# Altium schematic sheet ASK_Demodulation_and_thermistor_control.SchDoc
size A4; SheetNumber: 2; SheetTotal: 3
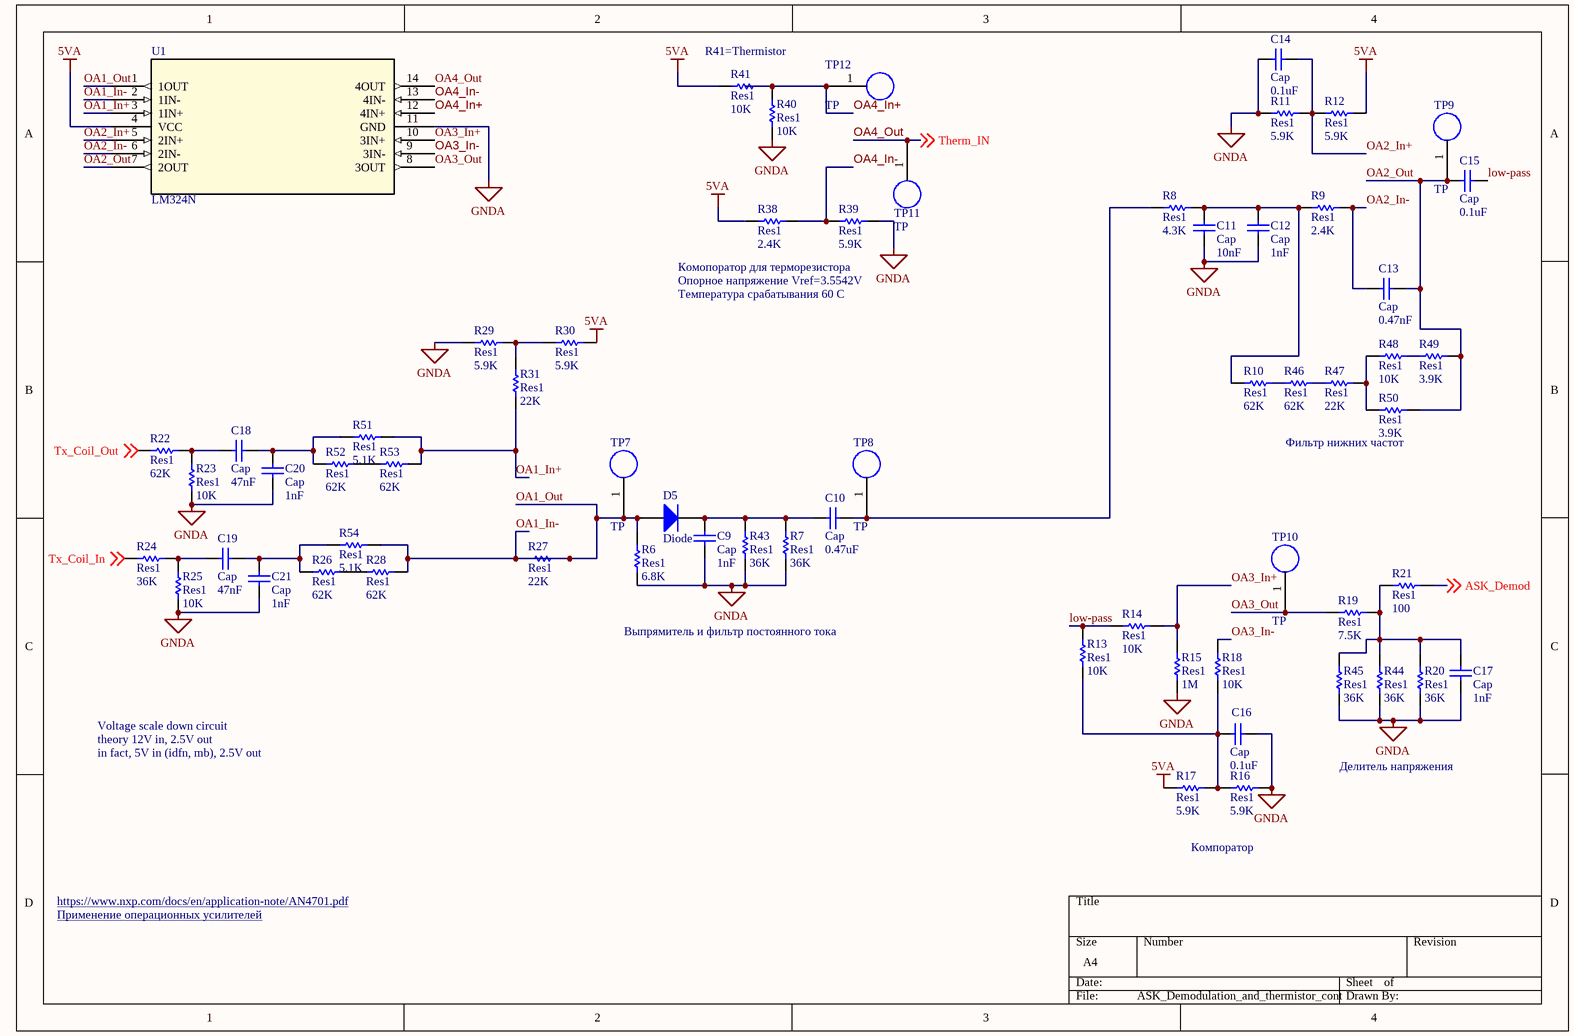
[diagram p0: ASK_Demodulation_and_thermistor_control.SchDoc]

## Parts
C9  Cap  value 1nF  [CAP 0402_1005]
C10  Cap  value 0.47uF  [CAP 0402_1005]
C11  Cap  value 10nF  [CAP 0402_1005]
C12  Cap  value 1nF  [CAP 0402_1005]
C13  Cap  value 0.47nF  [CAP 0402_1005]
C14  Cap  value 0.1uF  [CAP 0402_1005]
C15  Cap  value 0.1uF  [CAP 0402_1005]
C16  Cap  value 0.1uF  [CAP 0402_1005]
C17  Cap  value 1nF  [CAP 0402_1005]
C18  Cap  value 47nF  [CAP 0402_1005]
C19  Cap  value 47nF  [CAP 0402_1005]
C20  Cap  value 1nF  [CAP 0402_1005]
C21  Cap  value 1nF  [CAP 0402_1005]
D5  Diode  [SOD-123]
R6  Res1  value 6.8K  [RES 0402_1005]
R7  Res1  value 36K  [RES 0402_1005]
R8  Res1  value 4.3K  [RES 0402_1005]
R9  Res1  value 2.4K  [RES 0402_1005]
R10  Res1  value 62K  [RES 0402_1005]
R11  Res1  value 5.9K  [RES 0603_1608]
R12  Res1  value 5.9K  [RES 0603_1608]
R13  Res1  value 10K  [RES 0402_1005]
R14  Res1  value 10K  [RES 0402_1005]
R15  Res1  value 1M  [RES 0402_1005]
R16  Res1  value 5.9K  [RES 0603_1608]
R17  Res1  value 5.9K  [RES 0603_1608]
R18  Res1  value 10K  [RES 0402_1005]
R19  Res1  value 7.5K  [RES 0402_1005]
R20  Res1  value 36K  [RES 0402_1005]
R21  Res1  value 100  [RES 0402_1005]
R22  Res1  value 62K  [RES 0402_1005]
R23  Res1  value 10K  [RES 0402_1005]
R24  Res1  value 36K  [RES 0402_1005]
R25  Res1  value 10K  [RES 0402_1005]
R26  Res1  value 62K  [RES 0402_1005]
R27  Res1  value 22K  [RES 0402_1005]
R28  Res1  value 62K  [RES 0402_1005]
R29  Res1  value 5.9K  [RES 0603_1608]
R30  Res1  value 5.9K  [RES 0603_1608]
R31  Res1  value 22K  [RES 0402_1005]
R38  Res1  value 2.4K  [RES 0402_1005]
R39  Res1  value 5.9K  [RES 0603_1608]
R40  Res1  value 10K  [RES 0402_1005]
R41  Res1  value 10K  [RES 0402_1005]
R43  Res1  value 36K  [RES 0402_1005]
R44  Res1  value 36K  [RES 0402_1005]
R45  Res1  value 36K  [RES 0402_1005]
R46  Res1  value 62K  [RES 0402_1005]
R47  Res1  value 22K  [RES 0402_1005]
R48  Res1  value 10K  [RES 0402_1005]
R49  Res1  value 3.9K  [RES 0402_1005]
R50  Res1  value 3.9K  [RES 0402_1005]
R51  Res1  value 5.1K  [RES 0402_1005]
R52  Res1  value 62K  [RES 0402_1005]
R53  Res1  value 62K  [RES 0402_1005]
R54  Res1  value 5.1K  [RES 0402_1005]
TP7  TP  [Testpoint1]  (no BOM)
TP8  TP  [Testpoint1]  (no BOM)
TP9  TP  [Testpoint1]  (no BOM)
TP10  TP  [Testpoint1]  (no BOM)
TP11  TP  [Testpoint1]  (no BOM)
TP12  TP  [Testpoint1]  (no BOM)
U1  LM324N  [LM324NSR]

## Nets
5VA: R12.2 R17.1 R30.2 R38.1 R41.1 U1.4(VCC)
GNDA: C9.2 C11.1 C12.2 C14.1 C16.2 C17.2 C20.1 C21.2 R6.2 R7.2 R11.1 R15.2 R16.2 R20.1 R23.2 R25.1 R29.2 R39.2 R40.1 R43.2 R44.1 R45.1 U1.11(GND)
ASK_Demod: R21.2 ; off-sheet ASK_Demod
low-pass: C15.2 R13.2 R14.1
OA1_In+: R31.2 R51.2 R53.2 U1.3(1IN+)
OA1_In-: D5.1(A) R6.1 R27.1 R27.2 R28.2 R54.2 TP7.1 U1.1(1OUT) U1.2(1IN-)  [also labelled OA1_Out]
OA2_In+: C14.2 R11.2 R12.1 U1.5(2IN+)
OA2_In-: C13.1 R9.2 U1.6(2IN-)
OA2_Out: C13.2 C15.1 R49.2 R50.2 TP9.1 U1.7(2OUT)
OA3_In+: R14.2 R15.1 U1.10(3IN+)
OA3_In-: R18.2 U1.9(3IN-)
OA3_Out: R19.1 TP10.1 U1.8(3OUT)
OA4_In+: R40.2 R41.2 TP12.1 U1.12(4IN+)
OA4_In-: R38.2 R39.1 U1.13(4IN-)
OA4_Out: TP11.1 U1.14(4OUT) ; off-sheet Therm_IN  [also labelled Therm_IN]
Tx_Coil_In: R24.1 ; off-sheet Tx_Coil_In
Tx_Coil_Out: R22.2 ; off-sheet Tx_Coil_Out
NetC9_1: C9.1 C10.1 D5.2(K) R7.1 R43.1
NetC10_2: C10.2 R8.2 TP8.1
NetC11_2: C11.2 C12.1 R8.1 R9.1 R10.1
NetC16_1: C16.1 R13.1 R16.1 R17.2 R18.1
NetC17_1: C17.1 R19.2 R20.2 R21.1 R44.2 R45.2
NetC18_1: C18.1 R22.1 R23.1
NetC18_2: C18.2 C20.2 R51.1 R52.1
NetC19_1: C19.1 R24.2 R25.2
NetC19_2: C19.2 C21.1 R26.1 R54.1
NetR10_2: R10.2 R46.1
NetR26_2: R26.2 R28.1
NetR29_1: R29.1 R30.1 R31.1
NetR46_2: R46.2 R47.1
NetR47_2: R47.2 R48.1 R50.1
NetR48_2: R48.2 R49.1
NetR52_2: R52.2 R53.1

## Notes on the sheet
- R41=Thermistor
- Опорное напряжение Vref=3.5542V
- Комопоратор для терморезистора
- Температура срабатывания 60 С
- (near R50) Фильтр нижних частот
- Выпрямитель и фильтр постоянного тока
- Voltage scale down circuit
- theory 12V in, 2.5V out
- in fact, 5V in (idfn, mb), 2.5V out
- Делитель напряжения
- Компоратор
- https://www.nxp.com/docs/en/application-note/AN4701.pdf
- Применение операционных усилителей <https://ru.wikipedia.org/wiki/%D0%9F%D1%80%D0%B8%D0%BC%D0%B5%D0%BD%D0%B5%D0%BD%D0%B8%D0%B5_%D0%BE%D0%BF%D0%B5%D1%80%D0%B0%D1%86%D0%B8%D0%BE%D0%BD%D0%BD%D1%8B%D1%85_%D1%83%D1%81%D0%B8%D0%BB%D0%B8%D1%82%D0%B5%D0%BB%D0%B5%D0%B9>

## Library data of the parts
C9-C21 = Cap: Capacitor; Published: 8-Jun-2000; LatestRevisionDate: 17-Jul-2002; LatestRevisionNote: Re-released for DXP Platform.; PackageReference: RAD-0.3; Publisher: Altium Limited; PackageDescription: Radial Cap, Thru-Hole; 2 Leads; 0.3 in Pin Spacing
D5 = Diode: Default Diode; Published: 8-Jun-2000; LatestRevisionDate: 17-Jul-2002; LatestRevisionNote: Re-released for DXP Platform.; PackageVersion: Sep-1996; PackageReference: SMC; Publisher: Altium Limited; PackageDescription: DO-214-AB/SMC; 2 C-Bend Leads; Body 7.9 x 5.9 mm, inc. leads (LxW); Code_JEDEC: DO-214-AB
R6-R31 R38-R41 R43-R54 = Res1: Resistor; Published: 8-Jun-2000; LatestRevisionDate: 17-Jul-2002; LatestRevisionNote: Re-released for DXP Platform.; PackageReference: AXIAL-0.3; Publisher: Altium Limited; PackageDescription: Axial Device, Thru-Hole; 2 Leads; 0.3 in Pin Spacing
TP7-TP12 = Testpoint1
U1 = LM324N: No Description Available; Mfr_Name: Texas Instruments; RefDes: RefDes; Type: Type